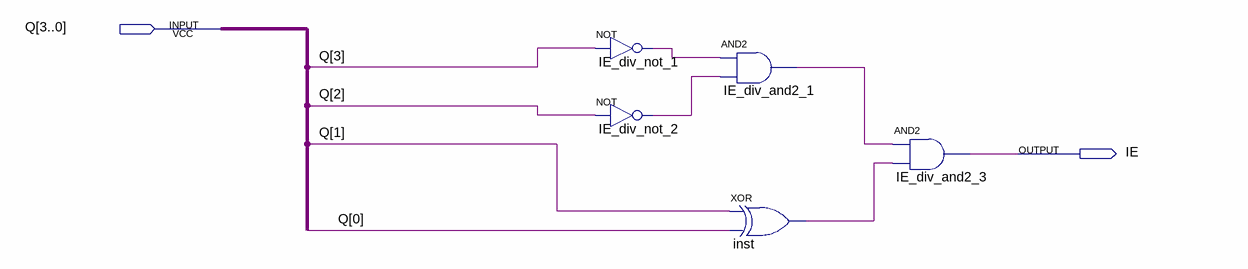
[diagram p0: schematic sheet]
// Quartus schematic IE_Divison.bdf as structural Verilog: 5 symbols, 2 pins
module IE_Divison (
  input  [3:0] Q,
  output IE
);

  wire IE_div_and2_1_out, IE_div_not_1_out, IE_div_not_2_out, inst_out;

  not IE_div_not_1 (IE_div_not_1_out, Q[3]);
  not IE_div_not_2 (IE_div_not_2_out, Q[2]);
  and IE_div_and2_1 (IE_div_and2_1_out, IE_div_not_1_out, IE_div_not_2_out);
  xor inst (inst_out, Q[1], Q[0]);
  and IE_div_and2_3 (IE, IE_div_and2_1_out, inst_out);
endmodule
